# Altium schematic sheet rs485.SchDoc
size A
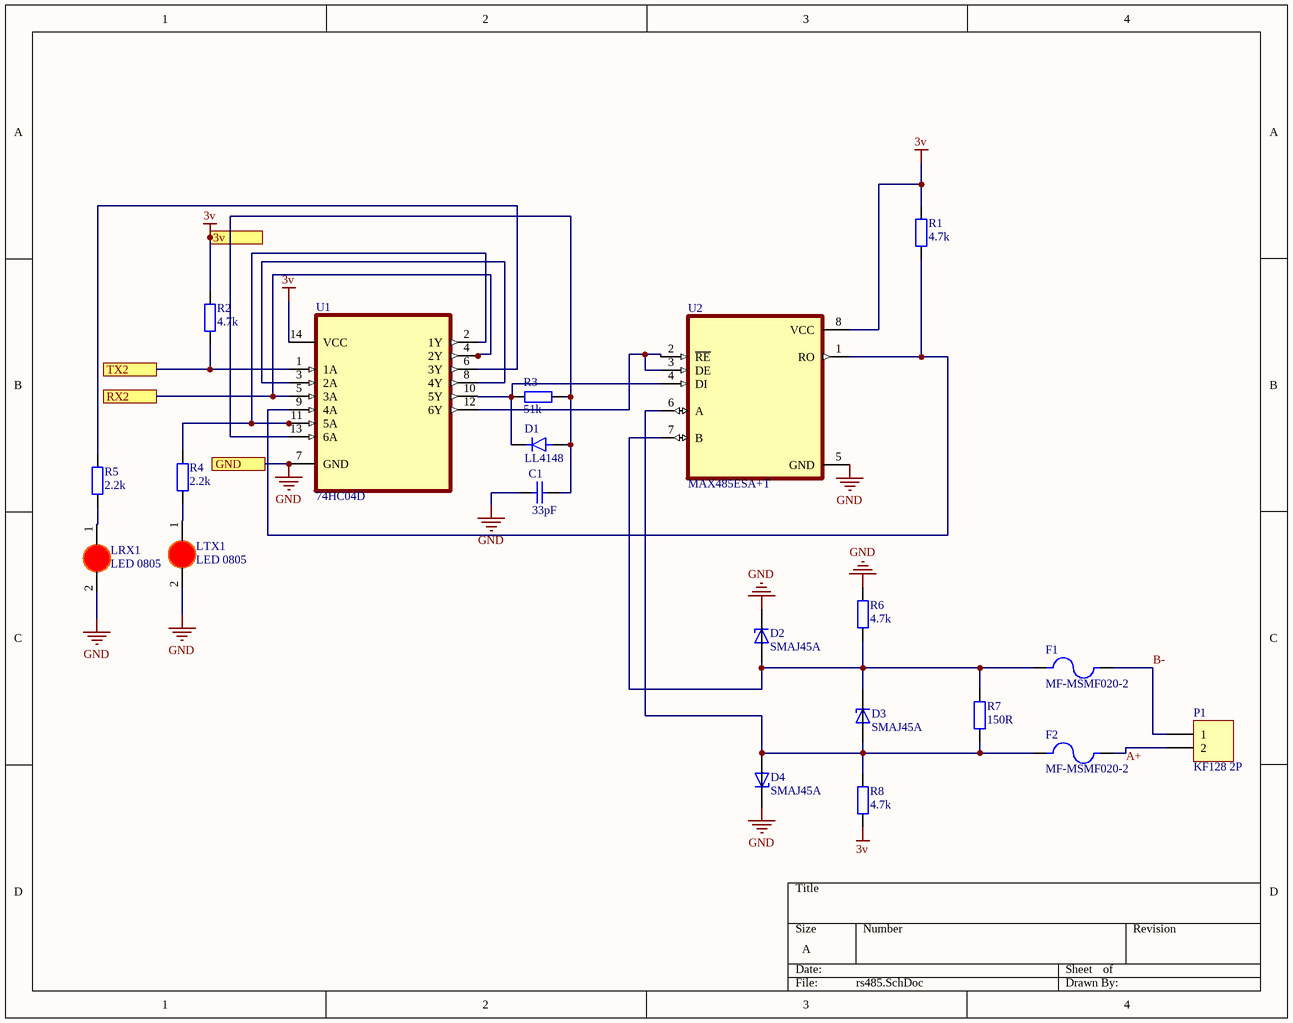
[diagram p0: rs485.SchDoc]

## Parts
C1  33pF  [tu 0805]
D1  LL4148  [DIO_LL4148]
D2  SMAJ45A  [DIOM4325X250N]
D3  SMAJ45A  [DIOM4325X250N]
D4  SMAJ45A  [DIOM4325X250N]
F1  MF-MSMF020-2  [FUSER_MF-MSMF020-2]
F2  MF-MSMF020-2  [FUSER_MF-MSMF020-2]
LRX1  LED 0805  [LED-0805-Red]
LTX1  LED 0805  [LED-0805-Red]
P1  KF128 2P  [KF128_2P]
R1  4.7k  [tro smd 0603]
R2  4.7k  [tro smd 0603]
R3  51k  [tro smd 0603]
R4  2.2k  [tro smd 0603]
R5  2.2k  [tro smd 0603]
R6  4.7k  [tro smd 0603]
R7  150R  [tro smd 0603]
R8  4.7k  [tro smd 0603]
U1  74HC04D  [SOIC127P600X175-14N]
U2  MAX485ESA+T  [SOIC127P600X175-8N]

## Ports
3v, GND, RX2, TX2

## Nets
3v: R1.2 R2.2 R8.1 U1.14(VCC) U2.8(VCC) ; port 3v
GND: C1.2 D2.C D4.C LRX1.2(K) LTX1.2(K) R6.2 U1.7(GND) U2.5(GND) ; port GND
A+: F2.2 P1.2
B-: F1.2 P1.1
RX2: U1.4(2Y) U1.5(3A) ; port RX2
TX2: R2.1 U1.1(1A) ; port TX2
NetC1_1: C1.1 D1.A R3.2 U1.13(6A)
NetD1_C: D1.C R3.1 U1.10(5Y) U2.4(DI)
NetD2_A: D2.A D3.C F1.1 R6.1 R7.2 U2.7(B)
NetD3_A: D3.A D4.A F2.1 R7.1 R8.2 U2.6(A)
NetLRX1_1: LRX1.1(A) R5.1
NetLTX1_1: LTX1.1(A) R4.1
NetR1_1: R1.1 U1.9(4A) U2.1(RO)
NetR4_2: R4.2 U1.2(1Y) U1.11(5A)
NetR5_2: R5.2 U1.6(3Y)
NetU1_3: U1.3(2A) U1.8(4Y)
NetU1_12: U1.12(6Y) U2.2(~{RE}) U2.3(DE)

## Library data of the parts
C1 = Tu 0805 33pF 50V 10%: Dán; Don_Vi: Con; So_Chan: 2; Ten_Linh_Kien: Tụ 0805 33p 10% 50V; Ma_Hang: MH004563; Chung_Loai: Dán; Kieu_Chan: *
D1 = LL4148: Diode Small Signal Switching 100V 0.15A Automotive 2-Pin Mini-MELF T/R; MF: Diotec Semiconductor; Value: *; SnapEDA_Link: https://www.snapeda.com/parts/LL4148/Diotec/view-part/?ref=snap; Purchase-URL: https://pricing.snapeda.com/search/part/LL4148/?ref=eda; Availability: In Stock; Price: None; Package: MINIMELF-2 Diotec; Check_prices: https://www.snapeda.com/parts/LL4148/Diotec/view-part/?ref=eda; MP: LL4148
D2-D4 = SMAJ45A: 72.7V Clamp 5.5A Ipp Tvs Diode Surface Mount DO-214AC (SMA); MF: Littelfuse; Value: *; Check_prices: https://www.snapeda.com/parts/SMAJ45A/Littelfuse/view-part/?ref=eda; Package: DO-214; Availability: Unavailable; SnapEDA_Link: https://www.snapeda.com/parts/SMAJ45A/Littelfuse/view-part/?ref=snap; MP: SMAJ45A; Price: None
F1 F2 = MF-MSMF020-2: Polymeric PTC Resettable Fuse 30V 200 mA Ih Surface Mount 1812 (4532 Metric), Concave; MF: Bourns; Package: 1812 Bourns; Price: None; MP: MF-MSMF020-2; Availability: In Stock; Value: *; Check_prices: https://www.snapeda.com/parts/MF-MSMF020-2/Bourns/view-part/?ref=eda; Purchase-URL: https://pricing.snapeda.com/search/part/MF-MSMF020-2/?ref=eda; SnapEDA_Link: https://www.snapeda.com/parts/MF-MSMF020-2/Bourns/view-part/?ref=snap
LRX1 LTX1 = LED 0805 Do: Dán; Don_Vi: Con; Ma_Hang: MH000897; Ten_Linh_Kien: LED 0805 Màu Đỏ (Red); Ghi_Chu: *; Kieu_Chan: *; Chung_Loai: Dán
P1 = KF128 2P: Header, 2-Pin, pitch 5.08mm; MPN: KF128-2P; Solder: WAVE
R1 R2 R6 R8 = Tro 0603 5% 4.7k: Dán; Don_Vi: Con; So_Chan: 2; Ten_Linh_Kien: Trở 0603 5% 4.7k; Ma_Hang: MH006327; Chung_Loai: Dán; Kieu_Chan: *
R3 = Tro 0603 5% 51k: Dán; Don_Vi: Con; So_Chan: 2; Ten_Linh_Kien: Trở 0603 5% 51k; Ma_Hang: MH007666; Chung_Loai: Dán; Kieu_Chan: *
R4 R5 = Tro 0603 5% 2.2k: Dán; Don_Vi: Con; So_Chan: 2; Ten_Linh_Kien: Trở 0603 5% 2.2k; Ma_Hang: MH006321; Chung_Loai: Dán; Kieu_Chan: *
R7 = Tro 0603 5% 150R: Dán; Don_Vi: Con; So_Chan: 2; Ten_Linh_Kien: Trở 0603 5% 150R; Ma_Hang: MH006318; Chung_Loai: Dán; Kieu_Chan: *
U1 = 74HC04D: Inverter IC 6 Channel 14-SOIC; MF: Toshiba; Value: *; MP: 74HC04D; Package: SOIC-14 NXP Semiconductors; Price: None; Availability: Unavailable; SnapEDA_Link: https://www.snapeda.com/parts/74HC04D/Toshiba%20Semiconductor%20and%20Storage/view-part/1040011/?ref=snap
U2 = MAX485ESA+T: 1/1 Transceiver Half RS422, RS485 8-SOIC; MF: Maxim Integrated; MP: MAX485ESA; SnapEDA_Link: https://www.snapeda.com/parts/MAX485ESA/Maxim+Integrated/view-part/?ref=snap; Purchase-URL: https://pricing.snapeda.com/search/part/MAX485ESA/?ref=eda; Value: *; Package: SOIC-8 Maxim; Price: None; Availability: In Stock; Check_prices: https://www.snapeda.com/parts/MAX485ESA/Maxim+Integrated/view-part/?ref=eda